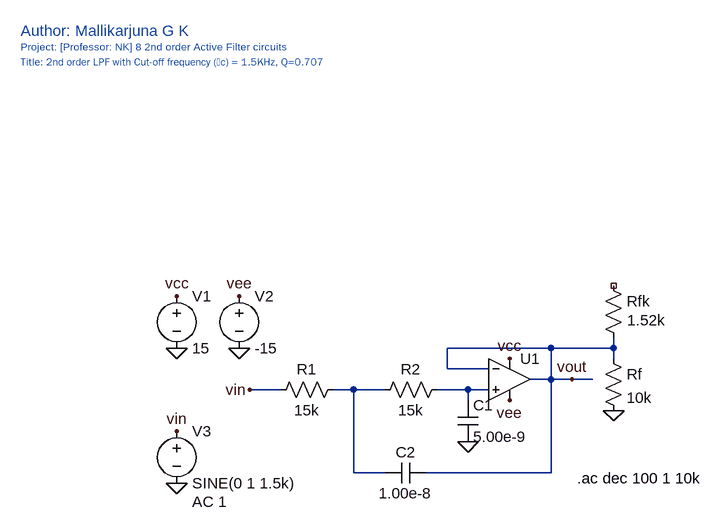
[diagram p0: schematic lpf_frequency_analysis.asc]
lpf_frequency_analysis.asc, the LTspice schematic file:
Version 4
SHEET 1 880 680
WIRE 368 112 208 112
WIRE 464 112 464 96
WIRE 464 112 368 112
WIRE 464 128 464 112
WIRE 208 144 208 112
WIRE 272 144 208 144
WIRE 368 160 368 112
WIRE 368 160 336 160
WIRE 400 160 368 160
WIRE 432 160 400 160
WIRE -48 176 -96 176
WIRE 64 176 32 176
WIRE 112 176 64 176
WIRE 240 176 192 176
WIRE 272 176 240 176
WIRE 240 192 240 176
WIRE 64 304 64 176
WIRE 112 304 64 304
WIRE 368 304 368 160
WIRE 368 304 176 304
FLAG 240 256 0
FLAG 464 208 0
FLAG -208 32 vcc
FLAG -112 32 vee
FLAG -208 112 0
FLAG -112 112 0
FLAG -208 320 0
FLAG -208 240 vin
FLAG 304 128 vcc
FLAG 304 192 vee
FLAG 400 160 vout
FLAG -96 176 vin
SYMBOL res 48 160 R90
WINDOW 0 0 56 VBottom 2
WINDOW 3 32 56 VTop 2
SYMATTR InstName R1
SYMATTR Value 15k
SYMBOL res 208 160 R90
WINDOW 0 0 56 VBottom 2
WINDOW 3 32 56 VTop 2
SYMATTR InstName R2
SYMATTR Value 15k
SYMBOL cap 224 192 R0
SYMATTR InstName C1
SYMATTR Value 5.00e-9
SYMBOL cap 176 288 R90
WINDOW 0 0 32 VBottom 2
WINDOW 3 32 32 VTop 2
SYMATTR InstName C2
SYMATTR Value 1.00e-8
SYMBOL res 448 0 R0
WINDOW 3 37 69 Left 2
SYMATTR InstName Rfk
SYMATTR Value 1.52k
SYMBOL res 448 112 R0
SYMATTR InstName Rf
SYMATTR Value 10k
SYMBOL OpAmps\\UniversalOpAmp 304 160 R0
SYMATTR InstName U1
SYMBOL voltage -208 16 R0
WINDOW 123 0 0 Left 0
WINDOW 39 0 0 Left 0
SYMATTR InstName V1
SYMATTR Value 15
SYMBOL voltage -112 16 R0
WINDOW 123 0 0 Left 0
WINDOW 39 0 0 Left 0
SYMATTR InstName V2
SYMATTR Value -15
SYMBOL voltage -208 224 R0
WINDOW 123 24 124 Left 2
WINDOW 39 0 0 Left 0
SYMATTR InstName V3
SYMATTR Value SINE(0 1 1.5k)
SYMATTR Value2 AC 1
TEXT 408 312 Left 2 !.ac dec 100 1 10k
TEXT -448 -376 Left 2 ;Author: Mallikarjuna G K
TEXT -448 -352 Left 1 ;Project: [Professor: NK] 8 2nd order Active Filter circuits
TEXT -448 -328 Left 1 ;Title: 2nd order LPF with Cut-off frequency (c) = 1.5KHz, Q=0.707

The netlist it stands for:
* lpf_frequency_analysis.asc
R1 N001 vin 15k
R2 N002 N001 15k
C1 N002 0 5.00e-9
C2 vout N001 1.00e-8
Rfk NC_01 vout 1.52k
Rf vout 0 10k
XU1 N002 vout vcc vee vout level1 Avol=1Meg GBW=10Meg Vos=0 En=0 Enk=0 In=0 Ink=0 Rin=500Meg  ; pins In+ In- V+ V- OUT
V1 vcc 0 15
V2 vee 0 -15
V3 vin 0 SINE(0 1 1.5k) AC 1
.ac dec 100 1 10k
* Author: Mallikarjuna G K
* Project: [Professor: NK] 8 2nd order Active Filter circuits
* Title: 2nd order LPF with Cut-off frequency (c) = 1.5KHz, Q=0.707
.lib UniversalOpAmp1.lib
.backanno
.end